# Altium schematic sheet v3score.SchDoc
size A1
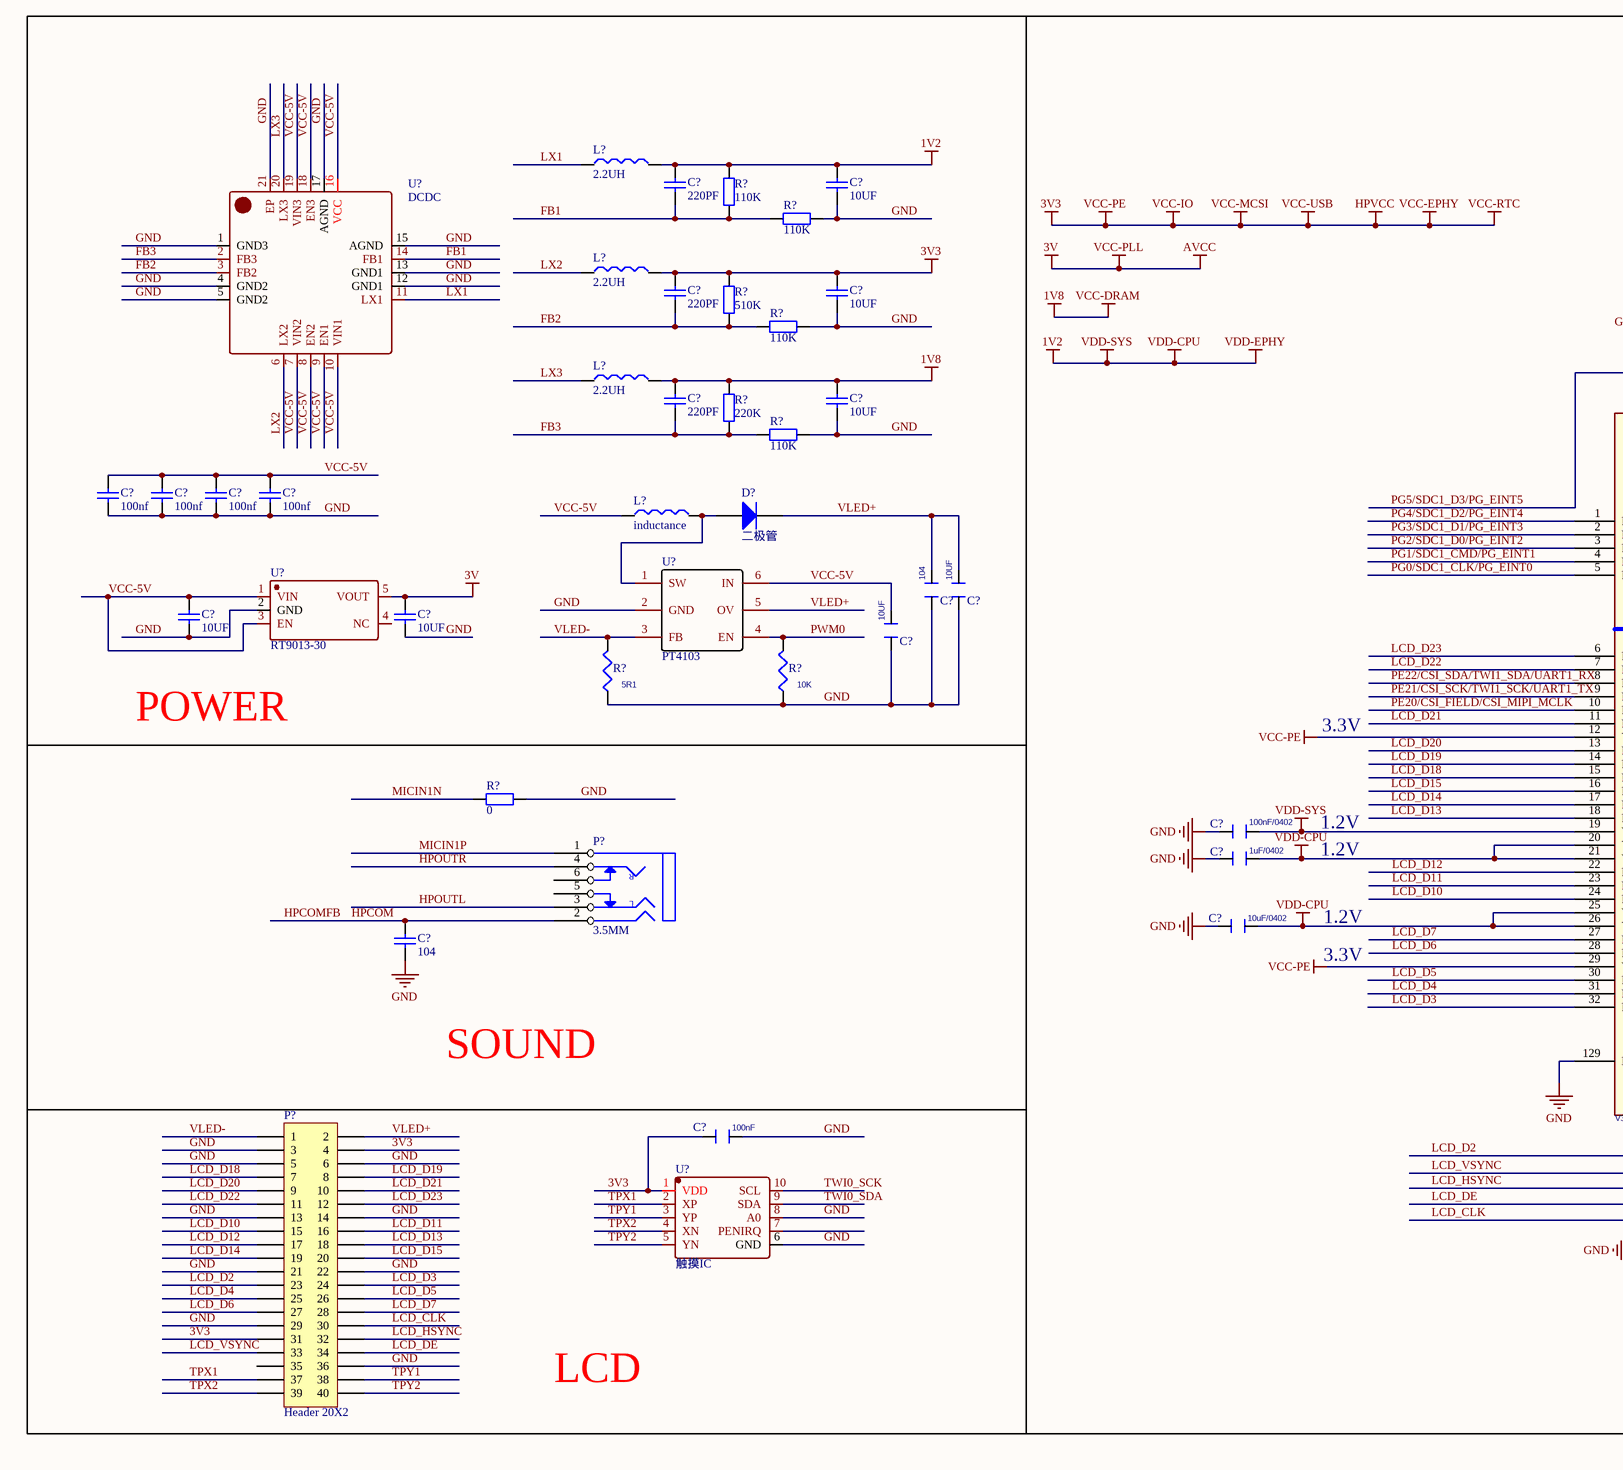
[diagram p0: v3score.SchDoc, left]
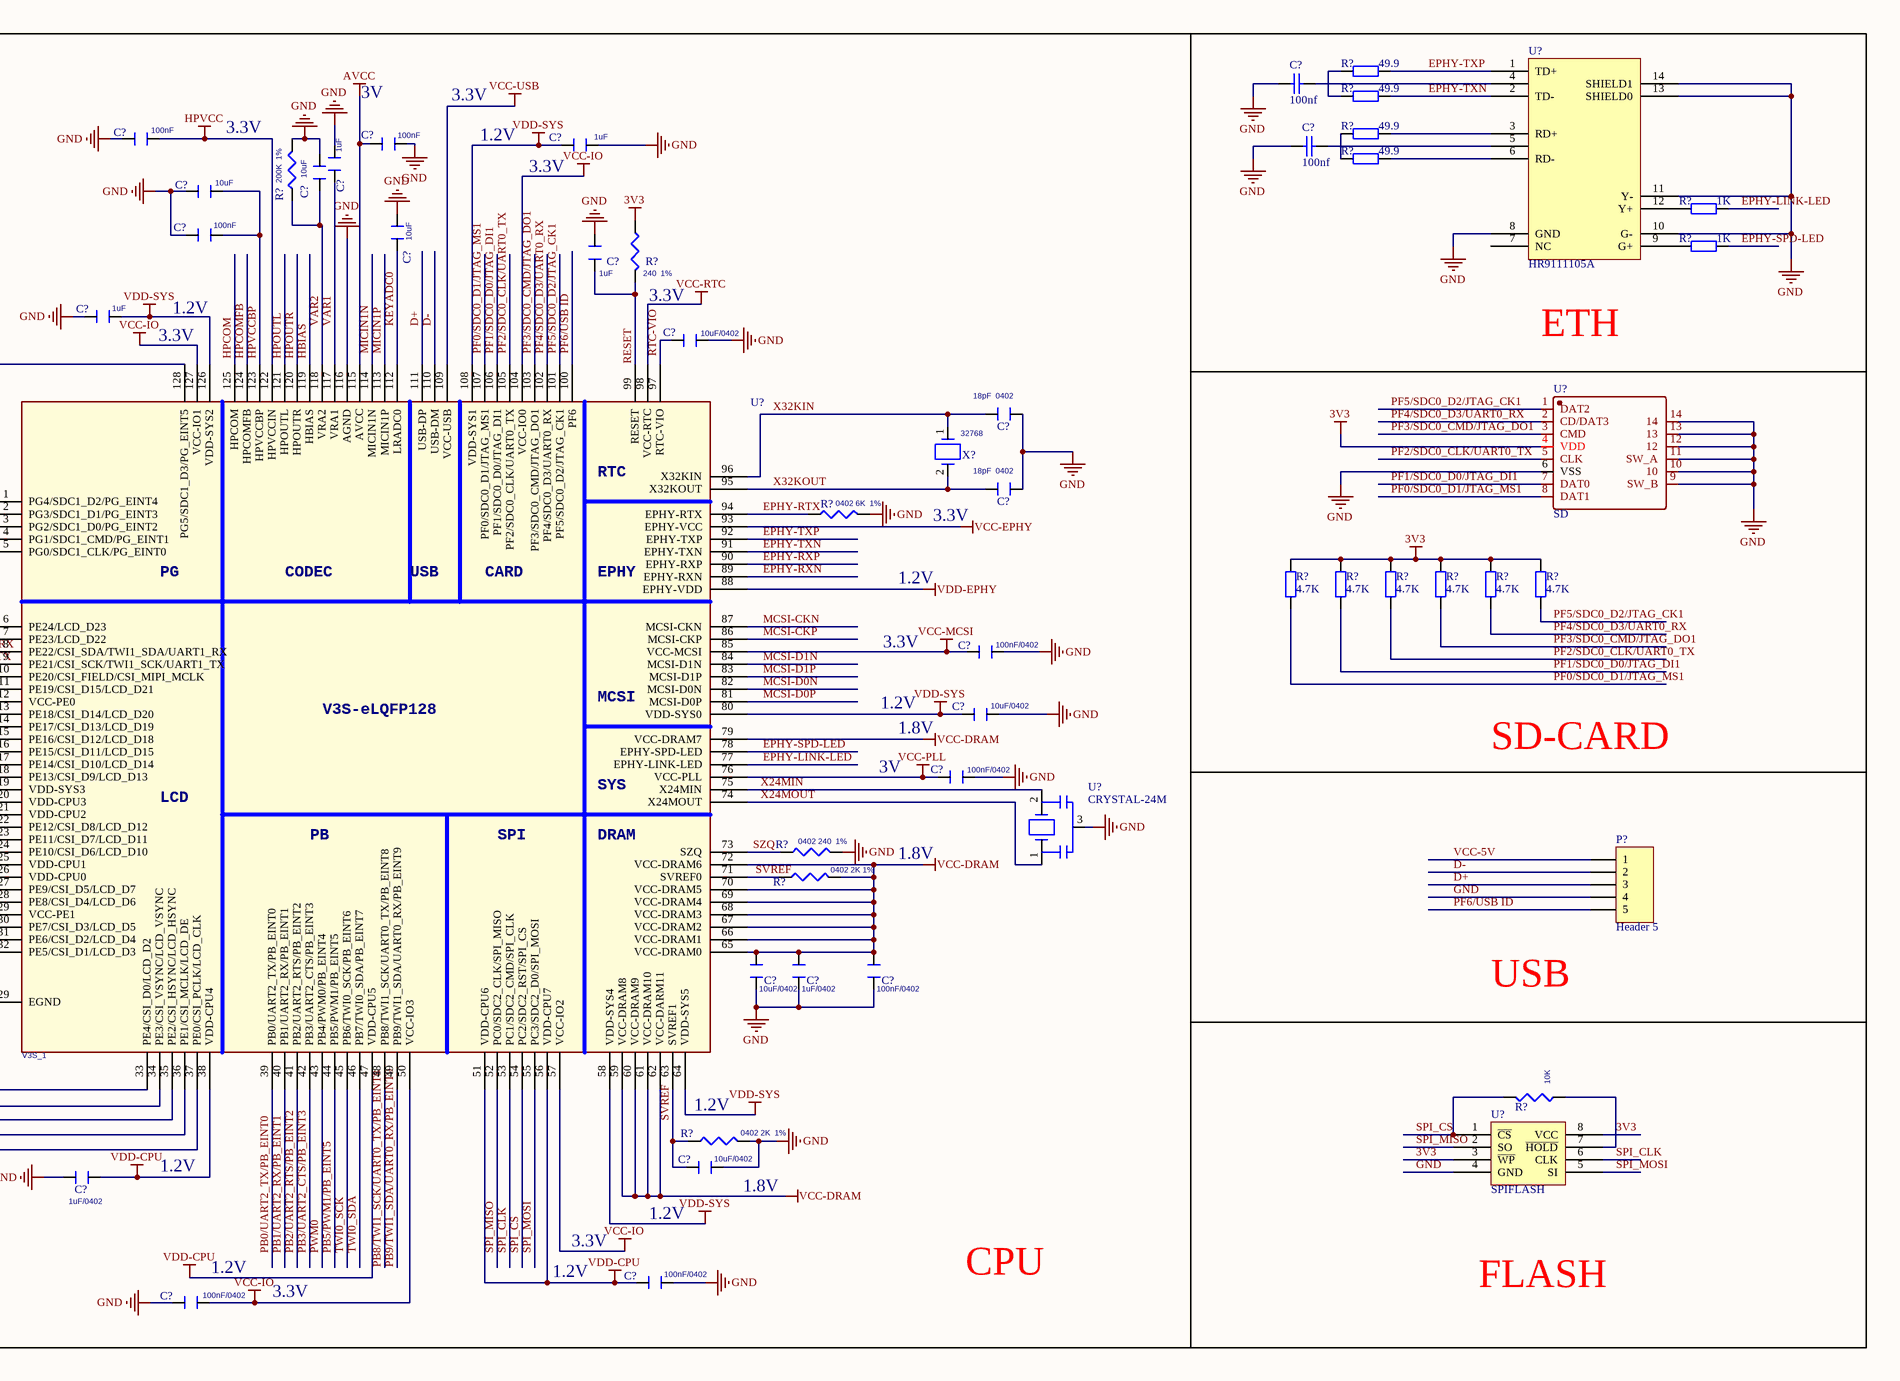
[diagram p1: v3score.SchDoc, right]

## Parts
(Parts that share a designator on the sheet are numbered #1, #2 ... from top to bottom, then left to right.)
C?#1  100nf  [R0603-LJN]
C?#2  100nF  [R0603-LJN]
C?#3  1uF  [R0603-LJN]
C?#4  100nF  [R0603-LJN]
C?#5  1uF  [R0603-LJN]
C?#6  100nf  [R0603-LJN]
C?#7  10uF  [R0603-LJN]
C?#8  10uF  [R0603-LJN]
C?#9  220PF  [R0603-LJN]
C?#10  10UF  [R0603-LJN]
C?#11  100nF  [R0603-LJN]
C?#12  10uF  [R0603-LJN]
C?#13  1uF  [R0603-LJN]
C?#14  1uF  [R0603-LJN]
C?#15  220PF  [R0603-LJN]
C?#16  10UF  [R0603-LJN]
C?#17  10uF/0402  [R0603-LJN]
C?#18  18pF  0402  [R0603-LJN]
C?#19  220PF  [R0603-LJN]
C?#20  10UF  [R0603-LJN]
C?#21  18pF  0402  [R0603-LJN]
C?#22  100nf  [R0603-LJN]
C?#23  100nf  [R0603-LJN]
C?#24  100nf  [R0603-LJN]
C?#25  100nf  [R0603-LJN]
C?#26  104  [R0603-LJN]
C?#27  10UF  [R0603-LJN]
C?#28  10UF  [R0603-LJN]
C?#29  10UF  [R0603-LJN]
C?#30  10UF  [R0603-LJN]
C?#31  100nF/0402  [R0603-LJN]
C?#32  10uF/0402  [R0603-LJN]
C?#33  100nF/0402  [R0603-LJN]
C?#34  100nF/0402  [R0603-LJN]
C?#35  1uF/0402  [R0603-LJN]
C?#36  10uF/0402  [R0603-LJN]
C?#37  104  [R0603-LJN]
C?#38  10uF/0402  [R0603-LJN]
C?#39  1uF/0402  [R0603-LJN]
C?#40  100nF/0402  [R0603-LJN]
C?#41  100nF  [R0603-LJN]
C?#42  1uF/0402  [R0603-LJN]
C?#43  10uF/0402  [R0603-LJN]
C?#44  100nF/0402  [R0603-LJN]
C?#45  100nF/0402  [R0603-LJN]
D?  二极管  [SOD-123]
L?#1  2.2UH  [C0805-LJN]
L?#2  2.2UH  [C0805-LJN]
L?#3  2.2UH  [C0805-LJN]
L?#4  inductance
P?#1  3.5MM  [PJ3537-3.5MM-LJN]
P?#2  Header 5  [USB-A/F-LJN]
P?#3  Header 20X2  [HDR2X20]
R?#1  49.9  [R0603-LJN]
R?#2  49.9  [R0603-LJN]
R?#3  49.9  [R0603-LJN]
R?#4  110K  [R0603-LJN]
R?#5  49.9  [R0603-LJN]
R?#6  200K  1%  [R0603-LJN]
R?#7  110K  [R0603-LJN]
R?#8  1K  [R0603-LJN]
R?#9  240  1%  [R0603-LJN]
R?#10  1K  [R0603-LJN]
R?#11  510K  [R0603-LJN]
R?#12  110K  [R0603-LJN]
R?#13  220K  [R0603-LJN]
R?#14  110K  [R0603-LJN]
R?#15  0402 6K  1%  [R0603-LJN]
R?#16  4.7K  [R0603-LJN]
R?#17  4.7K  [R0603-LJN]
R?#18  4.7K  [R0603-LJN]
R?#19  4.7K  [R0603-LJN]
R?#20  4.7K  [R0603-LJN]
R?#21  4.7K  [R0603-LJN]
R?#22  5R1  [R0603-LJN]
R?#23  10K  [R0603-LJN]
R?#24  0  [R0603-LJN]
R?#25  0402 240  1%  [R0603-LJN]
R?#26  0402 2K 1%  [R0603-LJN]
R?#27  10K  [R0603-LJN]
R?#28  0402 2K  1%  [R0603-LJN]
U?#1  HR9111105A
U?#2  DCDC  [QFN-20-LJN]
U?#3  V3S_1  [eLQFP128-V3S-LJN]
U?#4  SD  [SD-TF-14P-LJN]
U?#5  RT9013-30  [SOT23-5-LI]
U?#6  PT4103  [SOT23-6-LJN]
U?#7  CRYSTAL-24M  [X5032-LJN]
U?#8  触摸IC  [SSOP10-LJN]
U?#9  SPIFLASH  [SOP8150MIL-LJN]
X?  32768  [X5032-LJN]

## Blocks framed on the sheet
CPU: C?#2-C?#5 C?#7 C?#8 C?#11-C?#14 C?#17 C?#18 C?#21 C?#31-C?#36 C?#38-C?#40 C?#42-C?#45 R?#6 R?#9 R?#15 R?#25 R?#26 R?#28 U?#3 U?#7 X?

## Nets
1V2: C?#5.2 C?#9.2 C?#10.2 C?#14.2 C?#32.2 C?#33.2 C?#35.2 C?#36.2 C?#42.2 C?#44.1 L?#1.2 R?#4.1 U?#3.19(VDD-SYS3) U?#3.20(VDD-CPU3) U?#3.21(VDD-CPU2) U?#3.25(VDD-CPU1) U?#3.26(VDD-CPU0) U?#3.38(VDD-CPU4) U?#3.47(VDD-CPU5) U?#3.51(VDD-CPU6) U?#3.56(VDD-CPU7) U?#3.58(VDD-SYS4) U?#3.64(VDD-SYS5) U?#3.80(VDD-SYS0) U?#3.88(EPHY-VDD) U?#3.108(VDD-SYS1) U?#3.126(VDD-SYS2)  [also labelled VDD-CPU, VDD-EPHY, VDD-SYS]
1V8: C?#19.2 C?#20.2 C?#38.2 C?#39.2 C?#40.2 L?#3.2 R?#13.1 R?#26.2 U?#3.59(VCC-DRAM8) U?#3.60(VCC-DRAM9) U?#3.61(VCC-DRAM10) U?#3.62(VCC-DARM11) U?#3.65(VCC-DRAM0) U?#3.66(VCC-DRAM1) U?#3.67(VCC-DRAM2) U?#3.68(VCC-DRAM3) U?#3.69(VCC-DRAM4) U?#3.70(VCC-DRAM5) U?#3.72(VCC-DRAM6) U?#3.79(VCC-DRAM7)  [also labelled VCC-DRAM]
3V: C?#4.2 C?#30.2 C?#34.2 U?#3.76(VCC-PLL) U?#3.115(AVCC) U?#5.5(VOUT)  [also labelled AVCC, VCC-PLL]
3V3: C?#2.2 C?#15.2 C?#16.2 C?#31.2 C?#41.2 C?#45.2 L?#2.2 P?#3.4 P?#3.31 R?#9.1 R?#11.1 R?#16.2 R?#17.2 R?#18.2 R?#19.2 R?#20.2 R?#21.2 R?#27.1 U?#3.12(VCC-PE0) U?#3.29(VCC-PE1) U?#3.50(VCC-IO3) U?#3.57(VCC-IO2) U?#3.85(VCC-MCSI) U?#3.93(EPHY-VCC) U?#3.98(VCC-RTC) U?#3.104(VCC-IO0) U?#3.109(VCC-USB) U?#3.122(HPVCCIN) U?#3.127(VCC-IO1) U?#4.4(VDD) U?#8.1(VDD) U?#9.3(~{WP}) U?#9.7(~{HOLD}) U?#9.8(VCC)  [also labelled HPVCC, VCC-EPHY, VCC-IO, VCC-MCSI, VCC-PE, VCC-RTC, VCC-USB]
GND: C?#1.1 C?#2.1 C?#3.1 C?#4.1 C?#5.1 C?#6.1 C?#7.1 C?#8.1 C?#10.1 C?#11.1 C?#12.1 C?#13.1 C?#14.1 C?#16.1 C?#17.2 C?#18.2 C?#20.1 C?#21.2 C?#22.1 C?#23.1 C?#24.1 C?#25.1 C?#26.2 C?#27.2 C?#28.2 C?#29.1 C?#30.1 C?#31.1 C?#32.1 C?#33.1 C?#34.1 C?#35.1 C?#36.1 C?#37.2 C?#38.1 C?#39.1 C?#40.1 C?#41.1 C?#42.1 C?#43.1 C?#44.2 C?#45.1 P?#2.4 P?#3.3 P?#3.5 P?#3.6 P?#3.13 P?#3.14 P?#3.21 P?#3.22 P?#3.29 P?#3.36 R?#6.2 R?#7.1 R?#12.1 R?#14.1 R?#15.2 R?#22.1 R?#23.1 R?#24.1 R?#25.2 R?#28.2 U?#1.8(GND) U?#1.10(G-) U?#1.11(Y-) U?#1.13(SHIELD0) U?#1.14(SHIELD1) U?#2.1(GND3) U?#2.4(GND2) U?#2.5(GND2) U?#2.12(GND1) U?#2.13(GND1) U?#2.15(AGND) U?#2.17(AGND) U?#2.21(EP) U?#3.116(AGND) U?#3.129(EGND) U?#4.6(VSS) U?#4.9(SW_B) U?#4.10 U?#4.11(SW_A) U?#4.12 U?#4.13 U?#4.14 U?#5.2(GND) U?#6.2(GND) U?#7.3(Shield) U?#8.6(GND) U?#8.8(A0) U?#9.4(GND)
D+: P?#2.3 U?#3.111(USB-DP)
D-: P?#2.2 U?#3.110(USB-DM)
EPHY-LINK-LED: R?#8.2 U?#3.77(EPHY-LINK-LED)
EPHY-RTX: R?#15.1 U?#3.94(EPHY-RTX)
EPHY-RXN: U?#3.89(EPHY-RXN)
EPHY-RXP: U?#3.90(EPHY-RXP)
EPHY-SPD-LED: R?#10.2 U?#3.78(EPHY-SPD-LED)
EPHY-TXN: R?#2.2 U?#1.2(TD-) U?#3.91(EPHY-TXN)
EPHY-TXP: R?#1.2 U?#1.1(TD+) U?#3.92(EPHY-TXP)
FB1: C?#9.1 R?#4.2 R?#7.2 U?#2.14(FB1)
FB2: C?#15.1 R?#11.2 R?#12.2 U?#2.3(FB2)
FB3: C?#19.1 R?#13.2 R?#14.2 U?#2.2(FB3)
HBIAS: U?#3.119(HBIAS)
HPCOM: C?#37.1 P?#1.2 U?#3.124(HPCOMFB) U?#3.125(HPCOM)  [also labelled HPCOMFB]
HPOUTL: P?#1.3(A) U?#3.121(HPOUTL)
HPOUTR: P?#1.4(D) U?#3.120(HPOUTR)
HPVCCBP: C?#8.2 C?#11.2 U?#3.123(HPVCCBP)
KEYADC0: C?#12.2 U?#3.112(LRADC0)
LCD_CLK: P?#3.30 U?#3.37(PE0/CSI_PCLK/LCD_CLK)
LCD_D2: P?#3.23 U?#3.33(PE4/CSI_D0/LCD_D2)
LCD_D3: P?#3.24 U?#3.32(PE5/CSI_D1/LCD_D3)
LCD_D4: P?#3.25 U?#3.31(PE6/CSI_D2/LCD_D4)
LCD_D5: P?#3.26 U?#3.30(PE7/CSI_D3/LCD_D5)
LCD_D6: P?#3.27 U?#3.28(PE8/CSI_D4/LCD_D6)
LCD_D7: P?#3.28 U?#3.27(PE9/CSI_D5/LCD_D7)
LCD_D10: P?#3.15 U?#3.24(PE10/CSI_D6/LCD_D10)
LCD_D11: P?#3.16 U?#3.23(PE11/CSI_D7/LCD_D11)
LCD_D12: P?#3.17 U?#3.22(PE12/CSI_D8/LCD_D12)
LCD_D13: P?#3.18 U?#3.18(PE13/CSI_D9/LCD_D13)
LCD_D14: P?#3.19 U?#3.17(PE14/CSI_D10/LCD_D14)
LCD_D15: P?#3.20 U?#3.16(PE15/CSI_D11/LCD_D15)
LCD_D18: P?#3.7 U?#3.15(PE16/CSI_D12/LCD_D18)
LCD_D19: P?#3.8 U?#3.14(PE17/CSI_D13/LCD_D19)
LCD_D20: P?#3.9 U?#3.13(PE18/CSI_D14/LCD_D20)
LCD_D21: P?#3.10 U?#3.11(PE19/CSI_D15/LCD_D21)
LCD_D22: P?#3.11 U?#3.7(PE23/LCD_D22)
LCD_D23: P?#3.12 U?#3.6(PE24/LCD_D23)
LCD_DE: P?#3.34 U?#3.36(PE1/CSI_MCLK/LCD_DE)
LCD_HSYNC: P?#3.32 U?#3.35(PE2/CSI_HSYNC/LCD_HSYNC)
LCD_VSYNC: P?#3.33 U?#3.34(PE3/CSI_VSYNC/LCD_VSYNC)
LX1: L?#1.1 U?#2.11(LX1)
LX2: L?#2.1 U?#2.6(LX2)
LX3: L?#3.1 U?#2.20(LX3)
MCSI-CKN: U?#3.87(MCSI-CKN)
MCSI-CKP: U?#3.86(MCSI-CKP)
MCSI-D0N: U?#3.82(MCSI-D0N)
MCSI-D0P: U?#3.81(MCSI-D0P)
MCSI-D1N: U?#3.84(MCSI-D1N)
MCSI-D1P: U?#3.83(MCSI-D1P)
MICIN1N: R?#24.2 U?#3.114(MICIN1N)
MICIN1P: P?#1.1(E) U?#3.113(MICIN1P)
PB0/UART2_TX/PB_EINT0: U?#3.39(PB0/UART2_TX/PB_EINT0)
PB1/UART2_RX/PB_EINT1: U?#3.40(PB1/UART2_RX/PB_EINT1)
PB2/UART2_RTS/PB_EINT2: U?#3.41(PB2/UART2_RTS/PB_EINT2)
PB3/UART2_CTS/PB_EINT3: U?#3.42(PB3/UART2_CTS/PB_EINT3)
PB5/PWM1/PB_EINT5: U?#3.44(PB5/PWM1/PB_EINT5)
PB8/TWI1_SCK/UART0_TX/PB_EINT8: U?#3.48(PB8/TWI1_SCK/UART0_TX/PB_EINT8)
PB9/TWI1_SDA/UART0_RX/PB_EINT9: U?#3.49(PB9/TWI1_SDA/UART0_RX/PB_EINT9)
PE20/CSI_FIELD/CSI_MIPI_MCLK: U?#3.10(PE20/CSI_FIELD/CSI_MIPI_MCLK)
PE21/CSI_SCK/TWI1_SCK/UART1_TX: U?#3.9(PE21/CSI_SCK/TWI1_SCK/UART1_TX)
PE22/CSI_SDA/TWI1_SDA/UART1_RX: U?#3.8(PE22/CSI_SDA/TWI1_SDA/UART1_RX)
PF0/SDC0_D1/JTAG_MS1: R?#16.1 U?#3.107(PF0/SDC0_D1/JTAG_MS1) U?#4.8(DAT1)
PF1/SDC0_D0/JTAG_DI1: R?#17.1 U?#3.106(PF1/SDC0_D0/JTAG_DI1) U?#4.7(DAT0)
PF2/SDC0_CLK/UART0_TX: R?#18.1 U?#3.105(PF2/SDC0_CLK/UART0_TX) U?#4.5(CLK)
PF3/SDC0_CMD/JTAG_DO1: R?#19.1 U?#3.103(PF3/SDC0_CMD/JTAG_DO1) U?#4.3(CMD)
PF4/SDC0_D3/UART0_RX: R?#20.1 U?#3.102(PF4/SDC0_D3/UART0_RX) U?#4.2(CD/DAT3)
PF5/SDC0_D2/JTAG_CK1: R?#21.1 U?#3.101(PF5/SDC0_D2/JTAG_CK1) U?#4.1(DAT2)
PF6/USB ID: P?#2.5 U?#3.100(PF6)
PG0/SDC1_CLK/PG_EINT0: U?#3.5(PG0/SDC1_CLK/PG_EINT0)
PG1/SDC1_CMD/PG_EINT1: U?#3.4(PG1/SDC1_CMD/PG_EINT1)
PG2/SDC1_D0/PG_EINT2: U?#3.3(PG2/SDC1_D0/PG_EINT2)
PG3/SDC1_D1/PG_EINT3: U?#3.2(PG3/SDC1_D1/PG_EINT3)
PG4/SDC1_D2/PG_EINT4: U?#3.1(PG4/SDC1_D2/PG_EINT4)
PG5/SDC1_D3/PG_EINT5: U?#3.128(PG5/SDC1_D3/PG_EINT5)
PWM0: R?#23.2 U?#3.43(PB4/PWM0/PB_EINT4) U?#6.4(EN)
RESET: C?#13.2 R?#9.2 U?#3.99(RESET)
RTC-VIO: C?#17.1 U?#3.97(RTC-VIO)
SPI_CLK: U?#3.53(PC1/SDC2_CMD/SPI_CLK) U?#9.6(CLK)
SPI_CS: R?#27.2 U?#3.54(PC2/SDC2_RST/SPI_CS) U?#9.1(~{CS})
SPI_MISO: U?#3.52(PC0/SDC2_CLK/SPI_MISO) U?#9.2(SO)
SPI_MOSI: U?#3.55(PC3/SDC2_D0/SPI_MOSI) U?#9.5(SI)
SVREF: C?#43.2 R?#26.1 R?#28.1 U?#3.63(SVREF1) U?#3.71(SVREF0)
SZQ: R?#25.1 U?#3.73(SZQ)
TPX1: P?#3.37 U?#8.2(XP)
TPX2: P?#3.39 U?#8.4(XN)
TPY1: P?#3.38 U?#8.3(YP)
TPY2: P?#3.40 U?#8.5(YN)
TWI0_SCK: U?#3.45(PB6/TWI0_SCK/PB_EINT6) U?#8.10(SCL)
TWI0_SDA: U?#3.46(PB7/TWI0_SDA/PB_EINT7) U?#8.9(SDA)
VAR1: C?#3.2 U?#3.117(VRA1)
VAR2: C?#7.2 R?#6.1 U?#3.118(VRA2)
VCC-5V: C?#22.2 C?#23.2 C?#24.2 C?#25.2 C?#28.1 C?#29.2 L?#4.1 P?#2.1 U?#2.7(VIN2) U?#2.8(EN2) U?#2.9(EN1) U?#2.10(VIN1) U?#2.16(VCC) U?#2.18(EN3) U?#2.19(VIN3) U?#5.1(VIN) U?#5.3(EN) U?#6.6(IN)
VLED+: C?#26.1 C?#27.1 D?.2(K) P?#3.2 U?#6.5(OV)
VLED-: P?#3.1 R?#22.2 U?#6.3(FB)
X24MIN: U?#3.75(X24MIN) U?#7.2
X24MOUT: U?#3.74(X24MOUT) U?#7.1
X32KIN: C?#18.1 U?#3.96(X32KIN) X?.1
X32KOUT: C?#21.1 U?#3.95(X32KOUT) X?.2
NetC?#1_2: C?#1.2 U?#1.4
NetC?#6_2: C?#6.2 U?#1.5
NetD?_1: D?.1(A) L?#4.2 U?#6.1(SW)
NetR?#1_1: R?#1.1 R?#2.1
NetR?#3_1: R?#3.1 R?#5.1
NetR?#3_2: R?#3.2 U?#1.3(RD+)
NetR?#5_2: R?#5.2 U?#1.6(RD-)
NetR?#8_1: R?#8.1 U?#1.12(Y+)
NetR?#10_1: R?#10.1 U?#1.9(G+)

Not connected (* = marked no-connect by the designer): P?#1 5(B) 6(C); P?#3 35; U?#1 7(NC); U?#5 4(NC); U?#8 7(PENIRQ)

## Notes on the sheet
- (near R?#6) 3.3V
- (near C?#4) 3V
- 3.3V
- 1.2V
- (near C?#5) 3.3V
- ETH
- POWER
- (near C?#32) 1.8V
- SD-CARD
- 3V
- 1.8V
- SOUND
- USB
- (near R?#28) 1.2V
- (near C?#43) 1.2V
- LCD
- (near C?#45) 1.2V
- FLASH
- (in symbol PJ3537-3.5MM) R; L
- (in symbol V3S_1) RTC; PG; CODEC; USB; CARD; EPHY; MCSI; V3S-eLQFP128; SYS; LCD; PB; SPI; DRAM

## Library data of the parts
C?#1 C?#6 C?#9 C?#10 C?#15 C?#16 C?#19 C?#20 C?#22-C?#25 C?#29 C?#30 C?#37 = CAP
C?#2-C?#5 C?#7 C?#8 C?#11-C?#14 C?#17 C?#26-C?#28 C?#31-C?#36 C?#38-C?#45 = CAPACITOR_0
C?#18 C?#21 = CAPACITOR_Dup1
D? = DIODE
L?#1-L?#3 = Inductance
P?#1 = PJ3537-3.5MM
P?#2 = Header 5: Header, 5-Pin; LatestRevisionDate: 17-Jul-2002; LatestRevisionNote: Re-released for DXP Platform.; Publisher: Altium Limited
P?#3 = Header 20X2: Header, 20-Pin, Dual row; LatestRevisionDate: 17-Jul-2002; LatestRevisionNote: Re-released for DXP Platform.; Publisher: Altium Limited
R?#1-R?#5 R?#7 R?#8 R?#10-R?#14 R?#16-R?#21 R?#24 = RES
R?#6 R?#9 R?#15 R?#22 R?#23 R?#25-R?#28 = R1 0805
U?#2 = EA3036
U?#4 = SDCARD
U?#8 = NS2009
X? = CRYSTAL_XCOL-3